# Altium project S12642_0404_etap1.PrjPcb
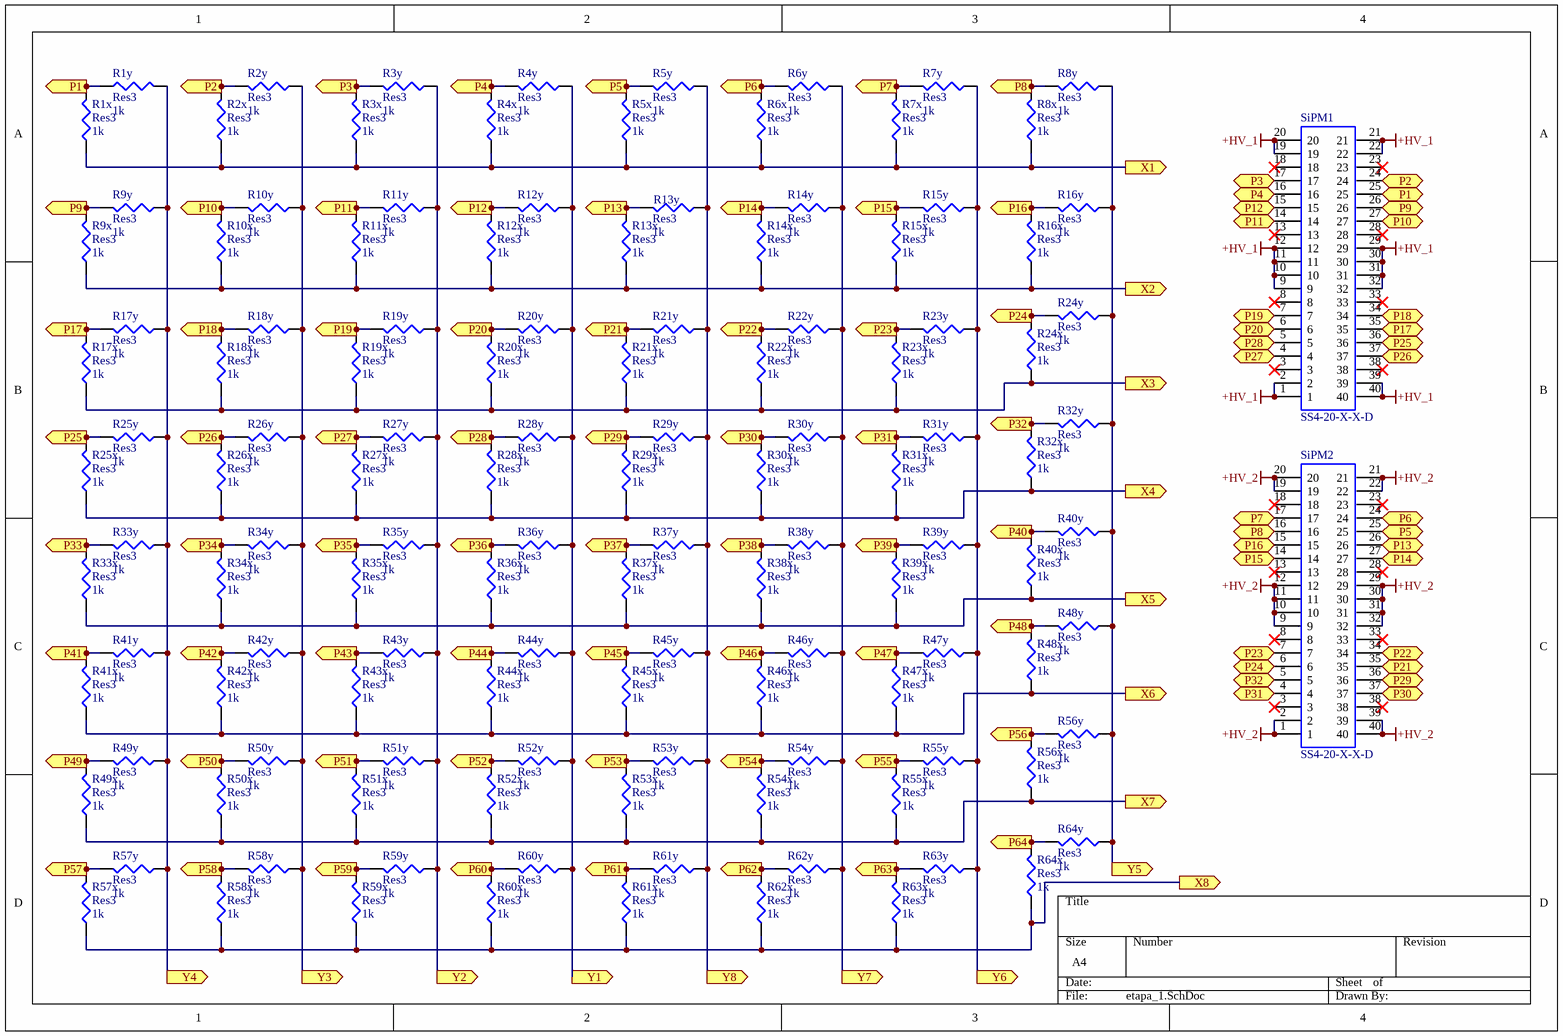
[diagram p0: etapa_1.SchDoc]
2 sheets, 218 parts. Net scope: flat (ports and power ports of the same name join across sheets).
Board file: etapa_1.PcbDoc
Sheets:
  etapa_1.SchDoc
  etapa_1_2.SchDoc

## Sheet etapa_1.SchDoc
size A4

### Parts
R1x  Res3  value 1k  [RES0201]
R1y  Res3  value 1k  [RES0201]
R2x  Res3  value 1k  [RES0201]
R2y  Res3  value 1k  [RES0201]
R3x  Res3  value 1k  [RES0201]
R3y  Res3  value 1k  [RES0201]
R4x  Res3  value 1k  [RES0201]
R4y  Res3  value 1k  [RES0201]
R5x  Res3  value 1k  [RES0201]
R5y  Res3  value 1k  [RES0201]
R6x  Res3  value 1k  [RES0201]
R6y  Res3  value 1k  [RES0201]
R7x  Res3  value 1k  [RES0201]
R7y  Res3  value 1k  [RES0201]
R8x  Res3  value 1k  [RES0201]
R8y  Res3  value 1k  [RES0201]
R9x  Res3  value 1k  [RES0201]
R9y  Res3  value 1k  [RES0201]
R10x  Res3  value 1k  [RES0201]
R10y  Res3  value 1k  [RES0201]
R11x  Res3  value 1k  [RES0201]
R11y  Res3  value 1k  [RES0201]
R12x  Res3  value 1k  [RES0201]
R12y  Res3  value 1k  [RES0201]
R13x  Res3  value 1k  [RES0201]
R13y  Res3  value 1k  [RES0201]
R14x  Res3  value 1k  [RES0201]
R14y  Res3  value 1k  [RES0201]
R15x  Res3  value 1k  [RES0201]
R15y  Res3  value 1k  [RES0201]
R16x  Res3  value 1k  [RES0201]
R16y  Res3  value 1k  [RES0201]
R17x  Res3  value 1k  [RES0201]
R17y  Res3  value 1k  [RES0201]
R18x  Res3  value 1k  [RES0201]
R18y  Res3  value 1k  [RES0201]
R19x  Res3  value 1k  [RES0201]
R19y  Res3  value 1k  [RES0201]
R20x  Res3  value 1k  [RES0201]
R20y  Res3  value 1k  [RES0201]
R21x  Res3  value 1k  [RES0201]
R21y  Res3  value 1k  [RES0201]
R22x  Res3  value 1k  [RES0201]
R22y  Res3  value 1k  [RES0201]
R23x  Res3  value 1k  [RES0201]
R23y  Res3  value 1k  [RES0201]
R24x  Res3  value 1k  [RES0201]
R24y  Res3  value 1k  [RES0201]
R25x  Res3  value 1k  [RES0201]
R25y  Res3  value 1k  [RES0201]
R26x  Res3  value 1k  [RES0201]
R26y  Res3  value 1k  [RES0201]
R27x  Res3  value 1k  [RES0201]
R27y  Res3  value 1k  [RES0201]
R28x  Res3  value 1k  [RES0201]
R28y  Res3  value 1k  [RES0201]
R29x  Res3  value 1k  [RES0201]
R29y  Res3  value 1k  [RES0201]
R30x  Res3  value 1k  [RES0201]
R30y  Res3  value 1k  [RES0201]
R31x  Res3  value 1k  [RES0201]
R31y  Res3  value 1k  [RES0201]
R32x  Res3  value 1k  [RES0201]
R32y  Res3  value 1k  [RES0201]
R33x  Res3  value 1k  [RES0201]
R33y  Res3  value 1k  [RES0201]
R34x  Res3  value 1k  [RES0201]
R34y  Res3  value 1k  [RES0201]
R35x  Res3  value 1k  [RES0201]
R35y  Res3  value 1k  [RES0201]
R36x  Res3  value 1k  [RES0201]
R36y  Res3  value 1k  [RES0201]
R37x  Res3  value 1k  [RES0201]
R37y  Res3  value 1k  [RES0201]
R38x  Res3  value 1k  [RES0201]
R38y  Res3  value 1k  [RES0201]
R39x  Res3  value 1k  [RES0201]
R39y  Res3  value 1k  [RES0201]
R40x  Res3  value 1k  [RES0201]
R40y  Res3  value 1k  [RES0201]
R41x  Res3  value 1k  [RES0201]
R41y  Res3  value 1k  [RES0201]
R42x  Res3  value 1k  [RES0201]
R42y  Res3  value 1k  [RES0201]
R43x  Res3  value 1k  [RES0201]
R43y  Res3  value 1k  [RES0201]
R44x  Res3  value 1k  [RES0201]
R44y  Res3  value 1k  [RES0201]
R45x  Res3  value 1k  [RES0201]
R45y  Res3  value 1k  [RES0201]
R46x  Res3  value 1k  [RES0201]
R46y  Res3  value 1k  [RES0201]
R47x  Res3  value 1k  [RES0201]
R47y  Res3  value 1k  [RES0201]
R48x  Res3  value 1k  [RES0201]
R48y  Res3  value 1k  [RES0201]
R49x  Res3  value 1k  [RES0201]
R49y  Res3  value 1k  [RES0201]
R50x  Res3  value 1k  [RES0201]
R50y  Res3  value 1k  [RES0201]
R51x  Res3  value 1k  [RES0201]
R51y  Res3  value 1k  [RES0201]
R52x  Res3  value 1k  [RES0201]
R52y  Res3  value 1k  [RES0201]
R53x  Res3  value 1k  [RES0201]
R53y  Res3  value 1k  [RES0201]
R54x  Res3  value 1k  [RES0201]
R54y  Res3  value 1k  [RES0201]
R55x  Res3  value 1k  [RES0201]
R55y  Res3  value 1k  [RES0201]
R56x  Res3  value 1k  [RES0201]
R56y  Res3  value 1k  [RES0201]
R57x  Res3  value 1k  [RES0201]
R57y  Res3  value 1k  [RES0201]
R58x  Res3  value 1k  [RES0201]
R58y  Res3  value 1k  [RES0201]
R59x  Res3  value 1k  [RES0201]
R59y  Res3  value 1k  [RES0201]
R60x  Res3  value 1k  [RES0201]
R60y  Res3  value 1k  [RES0201]
R61x  Res3  value 1k  [RES0201]
R61y  Res3  value 1k  [RES0201]
R62x  Res3  value 1k  [RES0201]
R62y  Res3  value 1k  [RES0201]
R63x  Res3  value 1k  [RES0201]
R63y  Res3  value 1k  [RES0201]
R64x  Res3  value 1k  [RES0201]
R64y  Res3  value 1k  [RES0201]
SiPM1  SS4-20-X-X-D  [SS4-20-X-X-D]
SiPM2  SS4-20-X-X-D  [SS4-20-X-X-D]

### Ports
P1 (in), P1 (out), P2 (in), P2 (out), P3 (in), P3 (out), P4 (in), P4 (out), P5 (in), P5 (out), P6 (in), P6 (out), P7 (in), P7 (out), P8 (in), P8 (out), P9 (in), P9 (out), P10 (in), P10 (out), P11 (in), P11 (out), P12 (in), P12 (out), P13 (in), P13 (out), P14 (in), P14 (out), P15 (in), P15 (out), P16 (in), P16 (out), P17 (in), P17 (out), P18 (in), P18 (out), P19 (in), P19 (out), P20 (in), P20 (out), P21 (in), P21 (out), P22 (in), P22 (out), P23 (in), P23 (out), P24 (in), P24 (out), P25 (in), P25 (out), P26 (in), P26 (out), P27 (in), P27 (out), P28 (in), P28 (out), P29 (in), P29 (out), P30 (in), P30 (out), P31 (in), P31 (out), P32 (in), P32 (out), P33 (out), P34 (out), P35 (out), P36 (out), P37 (out), P38 (out), P39 (out), P40 (out), P41 (out), P42 (out), P43 (out), P44 (out), P45 (out), P46 (out), P47 (out), P48 (out), P49 (out), P50 (out), P51 (out), P52 (out), P53 (out), P54 (out), P55 (out), P56 (out), P57 (out), P58 (out), P59 (out), P60 (out), P61 (out), P62 (out), P63 (out), P64 (out), X1 (out), X2 (out), X3 (out), X4 (out), X5 (out), X6 (out), X7 (out), X8 (out), Y1 (out), Y2 (out), Y3 (out), Y4 (out), Y5 (out), Y6 (out), Y7 (out), Y8 (out)

### Nets
+HV_1: SiPM1.1 SiPM1.2 SiPM1.9 SiPM1.10 SiPM1.11 SiPM1.12 SiPM1.19 SiPM1.20 SiPM1.21 SiPM1.22 SiPM1.29 SiPM1.30 SiPM1.31 SiPM1.32 SiPM1.39 SiPM1.40
+HV_2: SiPM2.1 SiPM2.2 SiPM2.9 SiPM2.10 SiPM2.11 SiPM2.12 SiPM2.19 SiPM2.20 SiPM2.21 SiPM2.22 SiPM2.29 SiPM2.30 SiPM2.31 SiPM2.32 SiPM2.39 SiPM2.40
NetR1n_2: R1x.2 R1y.1 SiPM1.25 ; port P1
NetR1x_1: R1x.1 R2x.1 R3x.1 R4x.1 R5x.1 R6x.1 R7x.1 R8x.1 ; port X1
NetR1y_2: R1y.2 R9y.1 R17y.1 R25y.1 R33y.1 R41y.1 R49y.1 R57y.1 ; port Y4
NetR2n_2: R2x.2 R2y.2 SiPM1.24 ; port P2
NetR2y_1: R2y.1 R10y.1 R18y.1 R26y.1 R34y.1 R42y.1 R50y.1 R58y.1 ; port Y3
NetR3n_2: R3x.2 R3y.2 SiPM1.17 ; port P3
NetR3y_1: R3y.1 R11y.1 R19y.1 R27y.1 R35y.1 R43y.1 R51y.1 R59y.1 ; port Y2
NetR4n_2: R4x.2 R4y.2 SiPM1.16 ; port P4
NetR4y_1: R4y.1 R12y.1 R20y.1 R28y.1 R36y.1 R44y.1 R52y.1 R60y.1 ; port Y1
NetR5n_2: R5x.2 R5y.2 SiPM2.25 ; port P5
NetR5y_1: R5y.1 R13y.1 R21y.1 R29y.1 R37y.1 R45y.1 R53y.1 R61y.1 ; port Y8
NetR6n_2: R6x.2 R6y.2 SiPM2.24 ; port P6
NetR6y_1: R6y.1 R14y.1 R22y.1 R30y.1 R38y.1 R46y.1 R54y.1 R62y.1 ; port Y7
NetR7n_2: R7x.2 R7y.2 SiPM2.17 ; port P7
NetR7y_1: R7y.1 R15y.1 R23y.1 R31y.1 R39y.1 R47y.1 R55y.1 R63y.1 ; port Y6
NetR8n_2: R8x.2 R8y.2 SiPM2.16 ; port P8
NetR8y_1: R8y.1 R16y.1 R24y.1 R32y.1 R40y.1 R48y.1 R56y.1 R64y.1 ; port Y5
NetR9n_2: R9x.2 R9y.2 SiPM1.26 ; port P9
NetR9x_1: R9x.1 R10x.1 R11x.1 R12x.1 R13x.1 R14x.1 R15x.1 R16x.1 ; port X2
NetR10n_2: R10x.2 R10y.2 SiPM1.27 ; port P10
NetR11n_2: R11x.2 R11y.2 SiPM1.14 ; port P11
NetR12n_2: R12x.2 R12y.2 SiPM1.15 ; port P12
NetR13n_2: R13x.2 R13y.2 SiPM2.26 ; port P13
NetR14n_2: R14x.2 R14y.2 SiPM2.27 ; port P14
NetR15n_2: R15x.2 R15y.2 SiPM2.14 ; port P15
NetR16n_2: R16x.2 R16y.2 SiPM2.15 ; port P16
NetR17n_2: R17x.2 R17y.2 SiPM1.35 ; port P17
NetR17x_1: R17x.1 R18x.1 R19x.1 R20x.1 R21x.1 R22x.1 R23x.1 R24x.1 ; port X3
NetR18n_2: R18x.2 R18y.2 SiPM1.34 ; port P18
NetR19n_2: R19x.2 R19y.2 SiPM1.7 ; port P19
NetR20n_2: R20x.2 R20y.2 SiPM1.6 ; port P20
NetR21n_2: R21x.2 R21y.2 SiPM2.35 ; port P21
NetR22n_2: R22x.2 R22y.2 SiPM2.34 ; port P22
NetR23n_2: R23x.2 R23y.2 SiPM2.7 ; port P23
NetR24n_2: R24x.2 R24y.2 SiPM2.6 ; port P24
NetR25n_2: R25x.2 R25y.2 SiPM1.36 ; port P25
NetR25x_1: R25x.1 R26x.1 R27x.1 R28x.1 R29x.1 R30x.1 R31x.1 R32x.1 ; port X4
NetR26n_2: R26x.2 R26y.2 SiPM1.37 ; port P26
NetR27n_2: R27x.2 R27y.2 SiPM1.4 ; port P27
NetR28n_2: R28x.2 R28y.2 SiPM1.5 ; port P28
NetR29n_2: R29x.2 R29y.2 SiPM2.36 ; port P29
NetR30n_2: R30x.2 R30y.2 SiPM2.37 ; port P30
NetR31n_2: R31x.2 R31y.2 SiPM2.4 ; port P31
NetR32n_2: R32x.2 R32y.2 SiPM2.5 ; port P32
NetR33n_2: R33x.2 R33y.2 ; port P33
NetR33x_1: R33x.1 R34x.1 R35x.1 R36x.1 R37x.1 R38x.1 R39x.1 R40x.1 ; port X5
NetR34n_2: R34x.2 R34y.2 ; port P34
NetR35n_2: R35x.2 R35y.2 ; port P35
NetR36n_2: R36x.2 R36y.2 ; port P36
NetR37n_2: R37x.2 R37y.2 ; port P37
NetR38n_2: R38x.2 R38y.2 ; port P38
NetR39n_2: R39x.2 R39y.2 ; port P39
NetR40n_2: R40x.2 R40y.2 ; port P40
NetR41n_2: R41x.2 R41y.2 ; port P41
NetR41x_1: R41x.1 R42x.1 R43x.1 R44x.1 R45x.1 R46x.1 R47x.1 R48x.1 ; port X6
NetR42n_2: R42x.2 R42y.2 ; port P42
NetR43n_2: R43x.2 R43y.2 ; port P43
NetR44n_2: R44x.2 R44y.2 ; port P44
NetR45n_2: R45x.2 R45y.2 ; port P45
NetR46n_2: R46x.2 R46y.2 ; port P46
NetR47n_2: R47x.2 R47y.2 ; port P47
NetR48n_2: R48x.2 R48y.2 ; port P48
NetR49n_2: R49x.2 R49y.2 ; port P49
NetR49x_1: R49x.1 R50x.1 R51x.1 R52x.1 R53x.1 R54x.1 R55x.1 R56x.1 ; port X7
NetR50n_2: R50x.2 R50y.2 ; port P50
NetR51n_2: R51x.2 R51y.2 ; port P51
NetR52n_2: R52x.2 R52y.2 ; port P52
NetR53n_2: R53x.2 R53y.2 ; port P53
NetR54n_2: R54x.2 R54y.2 ; port P54
NetR55n_2: R55x.2 R55y.2 ; port P55
NetR56n_2: R56x.2 R56y.2 ; port P56
NetR57n_2: R57x.2 R57y.2 ; port P57
NetR57x_1: R57x.1 R58x.1 R59x.1 R60x.1 R61x.1 R62x.1 R63x.1 R64x.1 ; port X8
NetR58n_2: R58x.2 R58y.2 ; port P58
NetR59n_2: R59x.2 R59y.2 ; port P59
NetR60n_2: R60x.2 R60y.2 ; port P60
NetR61n_2: R61x.2 R61y.2 ; port P61
NetR62n_2: R62x.2 R62y.2 ; port P62
NetR63n_2: R63x.2 R63y.2 ; port P63
NetR64n_2: R64x.2 R64y.2 ; port P64

Not connected (* = marked no-connect by the designer): SiPM1 3* 8* 13* 18* 23* 28* 33* 38*; SiPM2 3* 8* 13* 18* 23* 28* 33* 38*

### Library data of the parts
R1x R1y R2x R2y R3x R3y R4x R4y R5x R5y R6x R6y R7x R7y R8x R8y R9x R9y R10x R10y R11x R11y R12x R12y R13x R13y R14x R14y R15x R15y R16x R16y R17x R17y R18x R18y R19x R19y R20x R20y R21x R21y R22x R22y R23x R23y R24x R24y R25x R25y R26x R26y R27x R27y R28x R28y R29x R29y R30x R30y R31x R31y R32x R32y R33x R33y R34x R34y R35x R35y R36x R36y R37x R37y R38x R38y R39x R39y R40x R40y R41x R41y R42x R42y R43x R43y R44x R44y R45x R45y R46x R46y R47x R47y R48x R48y R49x R49y R50x R50y R51x R51y R52x R52y R53x R53y R54x R54y R55x R55y R56x R56y R57x R57y R58x R58y R59x R59y R60x R60y R61x R61y R62x R62y R63x R63y R64x R64y = Res3: Resistor; Published: 8-Jun-2000; LatestRevisionDate: 29-May-2009; LatestRevisionNote: IPC-7351 Footprint Added.; PackageReference: J1-0603; Publisher: Altium Limited; PackageDescription: Chip Resistor

## Sheet etapa_1_2.SchDoc
size A4
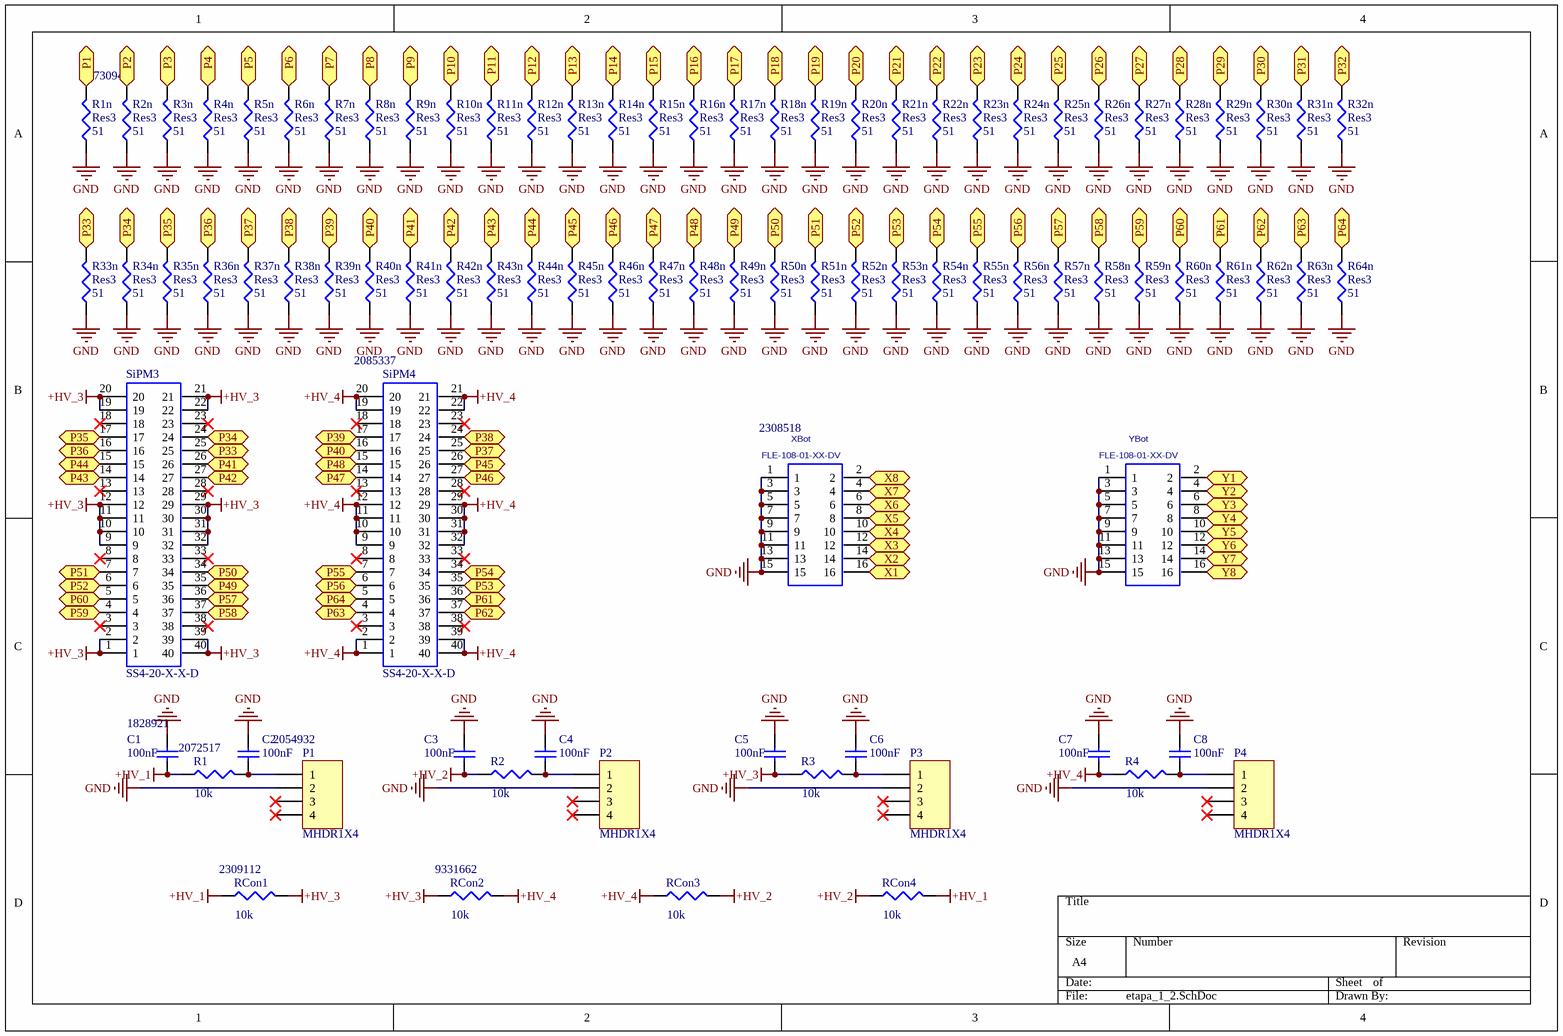
[diagram p1: etapa_1_2.SchDoc]

### Parts
C1  value 100nF  Supplier Part Number 1: 1828921  [1608[0603]]  (hidden comment: Cap Semi)
C2  value 100nF  [1608[0603]]  (hidden comment: Cap Semi)
C3  value 100nF  [1608[0603]]  (hidden comment: Cap Semi)
C4  value 100nF  [1608[0603]]  (hidden comment: Cap Semi)
C5  value 100nF  [1608[0603]]  (hidden comment: Cap Semi)
C6  value 100nF  [1608[0603]]  (hidden comment: Cap Semi)
C7  value 100nF  [1608[0603]]  (hidden comment: Cap Semi)
C8  value 100nF  [1608[0603]]  (hidden comment: Cap Semi)
P1  MHDR1X4  Supplier Part Number 1: 2054932  [MHDR1X4]
P2  MHDR1X4  [MHDR1X4]
P3  MHDR1X4  [MHDR1X4]
P4  MHDR1X4  [MHDR1X4]
R1  value 10k  Supplier Part Number 1: 2072517  [0402]  (hidden comment: Res3)
R1n  Res3  value 51  Supplier Part Number 1: 2073094  [0402]
R2  value 10k  [0402]  (hidden comment: Res3)
R2n  Res3  value 51  [0402]
R3  value 10k  [0402]  (hidden comment: Res3)
R3n  Res3  value 51  [0402]
R4  value 10k  [0402]  (hidden comment: Res3)
R4n  Res3  value 51  [0402]
R5n  Res3  value 51  [0402]
R6n  Res3  value 51  [0402]
R7n  Res3  value 51  [0402]
R8n  Res3  value 51  [0402]
R9n  Res3  value 51  [0402]
R10n  Res3  value 51  [0402]
R11n  Res3  value 51  [0402]
R12n  Res3  value 51  [0402]
R13n  Res3  value 51  [0402]
R14n  Res3  value 51  [0402]
R15n  Res3  value 51  [0402]
R16n  Res3  value 51  [0402]
R17n  Res3  value 51  [0402]
R18n  Res3  value 51  [0402]
R19n  Res3  value 51  [0402]
R20n  Res3  value 51  [0402]
R21n  Res3  value 51  [0402]
R22n  Res3  value 51  [0402]
R23n  Res3  value 51  [0402]
R24n  Res3  value 51  [0402]
R25n  Res3  value 51  [0402]
R26n  Res3  value 51  [0402]
R27n  Res3  value 51  [0402]
R28n  Res3  value 51  [0402]
R29n  Res3  value 51  [0402]
R30n  Res3  value 51  [0402]
R31n  Res3  value 51  [0402]
R32n  Res3  value 51  [0402]
R33n  Res3  value 51  [0402]
R34n  Res3  value 51  [0402]
R35n  Res3  value 51  [0402]
R36n  Res3  value 51  [0402]
R37n  Res3  value 51  [0402]
R38n  Res3  value 51  [0402]
R39n  Res3  value 51  [0402]
R40n  Res3  value 51  [0402]
R41n  Res3  value 51  [0402]
R42n  Res3  value 51  [0402]
R43n  Res3  value 51  [0402]
R44n  Res3  value 51  [0402]
R45n  Res3  value 51  [0402]
R46n  Res3  value 51  [0402]
R47n  Res3  value 51  [0402]
R48n  Res3  value 51  [0402]
R49n  Res3  value 51  [0402]
R50n  Res3  value 51  [0402]
R51n  Res3  value 51  [0402]
R52n  Res3  value 51  [0402]
R53n  Res3  value 51  [0402]
R54n  Res3  value 51  [0402]
R55n  Res3  value 51  [0402]
R56n  Res3  value 51  [0402]
R57n  Res3  value 51  [0402]
R58n  Res3  value 51  [0402]
R59n  Res3  value 51  [0402]
R60n  Res3  value 51  [0402]
R61n  Res3  value 51  [0402]
R62n  Res3  value 51  [0402]
R63n  Res3  value 51  [0402]
R64n  Res3  value 51  [0402]
RCon1  value 10k  Supplier Part Number 1: 2309112  [6-0805_M]  (hidden comment: Res3)
RCon2  value 10k  Supplier Part Number 1: 9331662  [1608[0603]]  (hidden comment: Res3)
RCon3  value 10k  [6-0805_M]  (hidden comment: Res3)
RCon4  value 10k  [1608[0603]]  (hidden comment: Res3)
SiPM3  SS4-20-X-X-D  [SS4-20-X-X-D]
SiPM4  SS4-20-X-X-D  Supplier Part Number 1: 2085337  [SS4-20-X-X-D]
XBot  FLE-108-01-XX-DV  Supplier Part Number 1: 2308518  [FLE-108-01-XX-DV]
YBot  FLE-108-01-XX-DV  [FLE-108-01-XX-DV]

### Ports
P1 (out), P2 (out), P3 (out), P4 (out), P5 (out), P6 (out), P7 (out), P8 (out), P9 (out), P10 (out), P11 (out), P12 (out), P13 (out), P14 (out), P15 (out), P16 (out), P17 (out), P18 (out), P19 (out), P20 (out), P21 (out), P22 (out), P23 (out), P24 (out), P25 (out), P26 (out), P27 (out), P28 (out), P29 (out), P30 (out), P31 (out), P32 (out), P33 (in), P33 (out), P34 (in), P34 (out), P35 (in), P35 (out), P36 (in), P36 (out), P37 (in), P37 (out), P38 (in), P38 (out), P39 (in), P39 (out), P40 (in), P40 (out), P41 (in), P41 (out), P42 (in), P42 (out), P43 (in), P43 (out), P44 (in), P44 (out), P45 (in), P45 (out), P46 (in), P46 (out), P47 (in), P47 (out), P48 (in), P48 (out), P49 (in), P49 (out), P50 (in), P50 (out), P51 (in), P51 (out), P52 (in), P52 (out), P53 (in), P53 (out), P54 (in), P54 (out), P55 (in), P55 (out), P56 (in), P56 (out), P57 (in), P57 (out), P58 (in), P58 (out), P59 (in), P59 (out), P60 (in), P60 (out), P61 (in), P61 (out), P62 (in), P62 (out), P63 (in), P63 (out), P64 (in), P64 (out), X1 (out), X2 (out), X3 (out), X4 (out), X5 (out), X6 (out), X7 (out), X8 (out), Y1 (out), Y2 (out), Y3 (out), Y4 (out), Y5 (out), Y6 (out), Y7 (out), Y8 (out)

### Nets
+HV_1: C1.2 R1.1 RCon1.1 RCon4.2
+HV_2: C3.2 R2.1 RCon3.2 RCon4.1
+HV_3: C5.2 R3.1 RCon1.2 RCon2.1 SiPM3.1 SiPM3.2 SiPM3.9 SiPM3.10 SiPM3.11 SiPM3.12 SiPM3.19 SiPM3.20 SiPM3.21 SiPM3.22 SiPM3.29 SiPM3.30 SiPM3.31 SiPM3.32 SiPM3.39 SiPM3.40
+HV_4: C7.2 R4.1 RCon2.2 RCon3.1 SiPM4.1 SiPM4.2 SiPM4.9 SiPM4.10 SiPM4.11 SiPM4.12 SiPM4.19 SiPM4.20 SiPM4.21 SiPM4.22 SiPM4.29 SiPM4.30 SiPM4.31 SiPM4.32 SiPM4.39 SiPM4.40
GND: C1.1 C2.2 C3.1 C4.2 C5.1 C6.2 C7.1 C8.2 P1.2 P2.2 P3.2 P4.2 R1n.1 R2n.1 R3n.1 R4n.1 R5n.1 R6n.1 R7n.1 R8n.1 R9n.1 R10n.1 R11n.1 R12n.1 R13n.1 R14n.1 R15n.1 R16n.1 R17n.1 R18n.1 R19n.1 R20n.1 R21n.1 R22n.1 R23n.1 R24n.1 R25n.1 R26n.1 R27n.1 R28n.1 R29n.1 R30n.1 R31n.1 R32n.1 R33n.1 R34n.1 R35n.1 R36n.1 R37n.1 R38n.1 R39n.1 R40n.1 R41n.1 R42n.1 R43n.1 R44n.1 R45n.1 R46n.1 R47n.1 R48n.1 R49n.1 R50n.1 R51n.1 R52n.1 R53n.1 R54n.1 R55n.1 R56n.1 R57n.1 R58n.1 R59n.1 R60n.1 R61n.1 R62n.1 R63n.1 R64n.1 XBot.1 XBot.3 XBot.5 XBot.7 XBot.9 XBot.11 XBot.13 XBot.15 YBot.1 YBot.3 YBot.5 YBot.7 YBot.9 YBot.11 YBot.13 YBot.15
NetC2_1: C2.1 P1.1 R1.2
NetC4_1: C4.1 P2.1 R2.2
NetC6_1: C6.1 P3.1 R3.2
NetC8_1: C8.1 P4.1 R4.2
NetR1n_2: R1n.2 ; port P1
NetR1x_1: XBot.16 ; port X1
NetR1y_2: YBot.8 ; port Y4
NetR2n_2: R2n.2 ; port P2
NetR2y_1: YBot.6 ; port Y3
NetR3n_2: R3n.2 ; port P3
NetR3y_1: YBot.4 ; port Y2
NetR4n_2: R4n.2 ; port P4
NetR4y_1: YBot.2 ; port Y1
NetR5n_2: R5n.2 ; port P5
NetR5y_1: YBot.16 ; port Y8
NetR6n_2: R6n.2 ; port P6
NetR6y_1: YBot.14 ; port Y7
NetR7n_2: R7n.2 ; port P7
NetR7y_1: YBot.12 ; port Y6
NetR8n_2: R8n.2 ; port P8
NetR8y_1: YBot.10 ; port Y5
NetR9n_2: R9n.2 ; port P9
NetR9x_1: XBot.14 ; port X2
NetR10n_2: R10n.2 ; port P10
NetR11n_2: R11n.2 ; port P11
NetR12n_2: R12n.2 ; port P12
NetR13n_2: R13n.2 ; port P13
NetR14n_2: R14n.2 ; port P14
NetR15n_2: R15n.2 ; port P15
NetR16n_2: R16n.2 ; port P16
NetR17n_2: R17n.2 ; port P17
NetR17x_1: XBot.12 ; port X3
NetR18n_2: R18n.2 ; port P18
NetR19n_2: R19n.2 ; port P19
NetR20n_2: R20n.2 ; port P20
NetR21n_2: R21n.2 ; port P21
NetR22n_2: R22n.2 ; port P22
NetR23n_2: R23n.2 ; port P23
NetR24n_2: R24n.2 ; port P24
NetR25n_2: R25n.2 ; port P25
NetR25x_1: XBot.10 ; port X4
NetR26n_2: R26n.2 ; port P26
NetR27n_2: R27n.2 ; port P27
NetR28n_2: R28n.2 ; port P28
NetR29n_2: R29n.2 ; port P29
NetR30n_2: R30n.2 ; port P30
NetR31n_2: R31n.2 ; port P31
NetR32n_2: R32n.2 ; port P32
NetR33n_2: R33n.2 SiPM3.25 ; port P33
NetR33x_1: XBot.8 ; port X5
NetR34n_2: R34n.2 SiPM3.24 ; port P34
NetR35n_2: R35n.2 SiPM3.17 ; port P35
NetR36n_2: R36n.2 SiPM3.16 ; port P36
NetR37n_2: R37n.2 SiPM4.25 ; port P37
NetR38n_2: R38n.2 SiPM4.24 ; port P38
NetR39n_2: R39n.2 SiPM4.17 ; port P39
NetR40n_2: R40n.2 SiPM4.16 ; port P40
NetR41n_2: R41n.2 SiPM3.26 ; port P41
NetR41x_1: XBot.6 ; port X6
NetR42n_2: R42n.2 SiPM3.27 ; port P42
NetR43n_2: R43n.2 SiPM3.14 ; port P43
NetR44n_2: R44n.2 SiPM3.15 ; port P44
NetR45n_2: R45n.2 SiPM4.26 ; port P45
NetR46n_2: R46n.2 SiPM4.27 ; port P46
NetR47n_2: R47n.2 SiPM4.14 ; port P47
NetR48n_2: R48n.2 SiPM4.15 ; port P48
NetR49n_2: R49n.2 SiPM3.35 ; port P49
NetR49x_1: XBot.4 ; port X7
NetR50n_2: R50n.2 SiPM3.34 ; port P50
NetR51n_2: R51n.2 SiPM3.7 ; port P51
NetR52n_2: R52n.2 SiPM3.6 ; port P52
NetR53n_2: R53n.2 SiPM4.35 ; port P53
NetR54n_2: R54n.2 SiPM4.34 ; port P54
NetR55n_2: R55n.2 SiPM4.7 ; port P55
NetR56n_2: R56n.2 SiPM4.6 ; port P56
NetR57n_2: R57n.2 SiPM3.36 ; port P57
NetR57x_1: XBot.2 ; port X8
NetR58n_2: R58n.2 SiPM3.37 ; port P58
NetR59n_2: R59n.2 SiPM3.4 ; port P59
NetR60n_2: R60n.2 SiPM3.5 ; port P60
NetR61n_2: R61n.2 SiPM4.36 ; port P61
NetR62n_2: R62n.2 SiPM4.37 ; port P62
NetR63n_2: R63n.2 SiPM4.4 ; port P63
NetR64n_2: R64n.2 SiPM4.5 ; port P64

Not connected (* = marked no-connect by the designer): P1 3* 4*; P2 3* 4*; P3 3* 4*; P4 3* 4*; SiPM3 3* 8* 13* 18* 23* 28* 33* 38*; SiPM4 3* 8* 13* 18* 23* 28* 33* 38*

### Library data of the parts
C1-C8 = Cap Semi: Capacitor (Semiconductor SIM Model); Published: 8-Jun-2000; LatestRevisionDate: 29-May-2009; LatestRevisionNote: IPC-7351 Footprint Added.; PackageReference: C1206; Publisher: Altium Limited; PackageDescription: Chip Capacitor
  C1: Supplier 1: Farnell
P1-P4 = MHDR1X4: Header, 4-Pin; LatestRevisionDate: 17-Jul-2002; LatestRevisionNote: Re-released for DXP Platform.; Publisher: Altium Limited
  P1: Supplier 1: Farnell
R1 R1n R2 R2n R3 R3n R4 R4n R5n R6n R7n R8n R9n R10n R11n R12n R13n R14n R15n R16n R17n R18n R19n R20n R21n R22n R23n R24n R25n R26n R27n R28n R29n R30n R31n R32n R33n R34n R35n R36n R37n R38n R39n R40n R41n R42n R43n R44n R45n R46n R47n R48n R49n R50n R51n R52n R53n R54n R55n R56n R57n R58n R59n R60n R61n R62n R63n R64n RCon1-RCon4 = Res3: Resistor; Published: 8-Jun-2000; LatestRevisionDate: 29-May-2009; LatestRevisionNote: IPC-7351 Footprint Added.; PackageReference: J1-0603; Publisher: Altium Limited; PackageDescription: Chip Resistor
  R1 R1n RCon1 RCon2: Supplier 1: Farnell
XBot YBot = FLE-108-01-XX-DV: DUAL ROW 0.050'' STRIP ASSEMBLY.; MANUFACTURER: SAMTEC; CREATED: December 2, 2014 - Wendy Xin; PCB DECAL: FLE-108-01-XX-DV
  XBot: Supplier 1: Farnell
SiPM3 SiPM4 = SS4-20-X-X-D
  SiPM4: Supplier 1: Farnell

## Nets that join several sheets
+HV_1: etapa_1 (16 pins), etapa_1_2 (C1.2 R1.1 RCon1.1 RCon4.2)
+HV_2: etapa_1 (16 pins), etapa_1_2 (C3.2 R2.1 RCon3.2 RCon4.1)
NetR1n_2: etapa_1 (R1x.2 R1y.1 SiPM1.25), etapa_1_2 (R1n.2)
NetR1x_1: etapa_1 (8 pins), etapa_1_2 (XBot.16)
NetR1y_2: etapa_1 (8 pins), etapa_1_2 (YBot.8)
NetR2n_2: etapa_1 (R2x.2 R2y.2 SiPM1.24), etapa_1_2 (R2n.2)
NetR2y_1: etapa_1 (8 pins), etapa_1_2 (YBot.6)
NetR3n_2: etapa_1 (R3x.2 R3y.2 SiPM1.17), etapa_1_2 (R3n.2)
NetR3y_1: etapa_1 (8 pins), etapa_1_2 (YBot.4)
NetR4n_2: etapa_1 (R4x.2 R4y.2 SiPM1.16), etapa_1_2 (R4n.2)
NetR4y_1: etapa_1 (8 pins), etapa_1_2 (YBot.2)
NetR5n_2: etapa_1 (R5x.2 R5y.2 SiPM2.25), etapa_1_2 (R5n.2)
NetR5y_1: etapa_1 (8 pins), etapa_1_2 (YBot.16)
NetR6n_2: etapa_1 (R6x.2 R6y.2 SiPM2.24), etapa_1_2 (R6n.2)
NetR6y_1: etapa_1 (8 pins), etapa_1_2 (YBot.14)
NetR7n_2: etapa_1 (R7x.2 R7y.2 SiPM2.17), etapa_1_2 (R7n.2)
NetR7y_1: etapa_1 (8 pins), etapa_1_2 (YBot.12)
NetR8n_2: etapa_1 (R8x.2 R8y.2 SiPM2.16), etapa_1_2 (R8n.2)
NetR8y_1: etapa_1 (8 pins), etapa_1_2 (YBot.10)
NetR9n_2: etapa_1 (R9x.2 R9y.2 SiPM1.26), etapa_1_2 (R9n.2)
NetR9x_1: etapa_1 (8 pins), etapa_1_2 (XBot.14)
NetR10n_2: etapa_1 (R10x.2 R10y.2 SiPM1.27), etapa_1_2 (R10n.2)
NetR11n_2: etapa_1 (R11x.2 R11y.2 SiPM1.14), etapa_1_2 (R11n.2)
NetR12n_2: etapa_1 (R12x.2 R12y.2 SiPM1.15), etapa_1_2 (R12n.2)
NetR13n_2: etapa_1 (R13x.2 R13y.2 SiPM2.26), etapa_1_2 (R13n.2)
NetR14n_2: etapa_1 (R14x.2 R14y.2 SiPM2.27), etapa_1_2 (R14n.2)
NetR15n_2: etapa_1 (R15x.2 R15y.2 SiPM2.14), etapa_1_2 (R15n.2)
NetR16n_2: etapa_1 (R16x.2 R16y.2 SiPM2.15), etapa_1_2 (R16n.2)
NetR17n_2: etapa_1 (R17x.2 R17y.2 SiPM1.35), etapa_1_2 (R17n.2)
NetR17x_1: etapa_1 (8 pins), etapa_1_2 (XBot.12)
NetR18n_2: etapa_1 (R18x.2 R18y.2 SiPM1.34), etapa_1_2 (R18n.2)
NetR19n_2: etapa_1 (R19x.2 R19y.2 SiPM1.7), etapa_1_2 (R19n.2)
NetR20n_2: etapa_1 (R20x.2 R20y.2 SiPM1.6), etapa_1_2 (R20n.2)
NetR21n_2: etapa_1 (R21x.2 R21y.2 SiPM2.35), etapa_1_2 (R21n.2)
NetR22n_2: etapa_1 (R22x.2 R22y.2 SiPM2.34), etapa_1_2 (R22n.2)
NetR23n_2: etapa_1 (R23x.2 R23y.2 SiPM2.7), etapa_1_2 (R23n.2)
NetR24n_2: etapa_1 (R24x.2 R24y.2 SiPM2.6), etapa_1_2 (R24n.2)
NetR25n_2: etapa_1 (R25x.2 R25y.2 SiPM1.36), etapa_1_2 (R25n.2)
NetR25x_1: etapa_1 (8 pins), etapa_1_2 (XBot.10)
NetR26n_2: etapa_1 (R26x.2 R26y.2 SiPM1.37), etapa_1_2 (R26n.2)
NetR27n_2: etapa_1 (R27x.2 R27y.2 SiPM1.4), etapa_1_2 (R27n.2)
NetR28n_2: etapa_1 (R28x.2 R28y.2 SiPM1.5), etapa_1_2 (R28n.2)
NetR29n_2: etapa_1 (R29x.2 R29y.2 SiPM2.36), etapa_1_2 (R29n.2)
NetR30n_2: etapa_1 (R30x.2 R30y.2 SiPM2.37), etapa_1_2 (R30n.2)
NetR31n_2: etapa_1 (R31x.2 R31y.2 SiPM2.4), etapa_1_2 (R31n.2)
NetR32n_2: etapa_1 (R32x.2 R32y.2 SiPM2.5), etapa_1_2 (R32n.2)
NetR33n_2: etapa_1 (R33x.2 R33y.2), etapa_1_2 (R33n.2 SiPM3.25)
NetR33x_1: etapa_1 (8 pins), etapa_1_2 (XBot.8)
NetR34n_2: etapa_1 (R34x.2 R34y.2), etapa_1_2 (R34n.2 SiPM3.24)
NetR35n_2: etapa_1 (R35x.2 R35y.2), etapa_1_2 (R35n.2 SiPM3.17)
NetR36n_2: etapa_1 (R36x.2 R36y.2), etapa_1_2 (R36n.2 SiPM3.16)
NetR37n_2: etapa_1 (R37x.2 R37y.2), etapa_1_2 (R37n.2 SiPM4.25)
NetR38n_2: etapa_1 (R38x.2 R38y.2), etapa_1_2 (R38n.2 SiPM4.24)
NetR39n_2: etapa_1 (R39x.2 R39y.2), etapa_1_2 (R39n.2 SiPM4.17)
NetR40n_2: etapa_1 (R40x.2 R40y.2), etapa_1_2 (R40n.2 SiPM4.16)
NetR41n_2: etapa_1 (R41x.2 R41y.2), etapa_1_2 (R41n.2 SiPM3.26)
NetR41x_1: etapa_1 (8 pins), etapa_1_2 (XBot.6)
NetR42n_2: etapa_1 (R42x.2 R42y.2), etapa_1_2 (R42n.2 SiPM3.27)
NetR43n_2: etapa_1 (R43x.2 R43y.2), etapa_1_2 (R43n.2 SiPM3.14)
NetR44n_2: etapa_1 (R44x.2 R44y.2), etapa_1_2 (R44n.2 SiPM3.15)
NetR45n_2: etapa_1 (R45x.2 R45y.2), etapa_1_2 (R45n.2 SiPM4.26)
NetR46n_2: etapa_1 (R46x.2 R46y.2), etapa_1_2 (R46n.2 SiPM4.27)
NetR47n_2: etapa_1 (R47x.2 R47y.2), etapa_1_2 (R47n.2 SiPM4.14)
NetR48n_2: etapa_1 (R48x.2 R48y.2), etapa_1_2 (R48n.2 SiPM4.15)
NetR49n_2: etapa_1 (R49x.2 R49y.2), etapa_1_2 (R49n.2 SiPM3.35)
NetR49x_1: etapa_1 (8 pins), etapa_1_2 (XBot.4)
NetR50n_2: etapa_1 (R50x.2 R50y.2), etapa_1_2 (R50n.2 SiPM3.34)
NetR51n_2: etapa_1 (R51x.2 R51y.2), etapa_1_2 (R51n.2 SiPM3.7)
NetR52n_2: etapa_1 (R52x.2 R52y.2), etapa_1_2 (R52n.2 SiPM3.6)
NetR53n_2: etapa_1 (R53x.2 R53y.2), etapa_1_2 (R53n.2 SiPM4.35)
NetR54n_2: etapa_1 (R54x.2 R54y.2), etapa_1_2 (R54n.2 SiPM4.34)
NetR55n_2: etapa_1 (R55x.2 R55y.2), etapa_1_2 (R55n.2 SiPM4.7)
NetR56n_2: etapa_1 (R56x.2 R56y.2), etapa_1_2 (R56n.2 SiPM4.6)
NetR57n_2: etapa_1 (R57x.2 R57y.2), etapa_1_2 (R57n.2 SiPM3.36)
NetR57x_1: etapa_1 (8 pins), etapa_1_2 (XBot.2)
NetR58n_2: etapa_1 (R58x.2 R58y.2), etapa_1_2 (R58n.2 SiPM3.37)
NetR59n_2: etapa_1 (R59x.2 R59y.2), etapa_1_2 (R59n.2 SiPM3.4)
NetR60n_2: etapa_1 (R60x.2 R60y.2), etapa_1_2 (R60n.2 SiPM3.5)
NetR61n_2: etapa_1 (R61x.2 R61y.2), etapa_1_2 (R61n.2 SiPM4.36)
NetR62n_2: etapa_1 (R62x.2 R62y.2), etapa_1_2 (R62n.2 SiPM4.37)
NetR63n_2: etapa_1 (R63x.2 R63y.2), etapa_1_2 (R63n.2 SiPM4.4)
NetR64n_2: etapa_1 (R64x.2 R64y.2), etapa_1_2 (R64n.2 SiPM4.5)